# Altium project RFR_Charging_2025_Circuit.PrjPcb
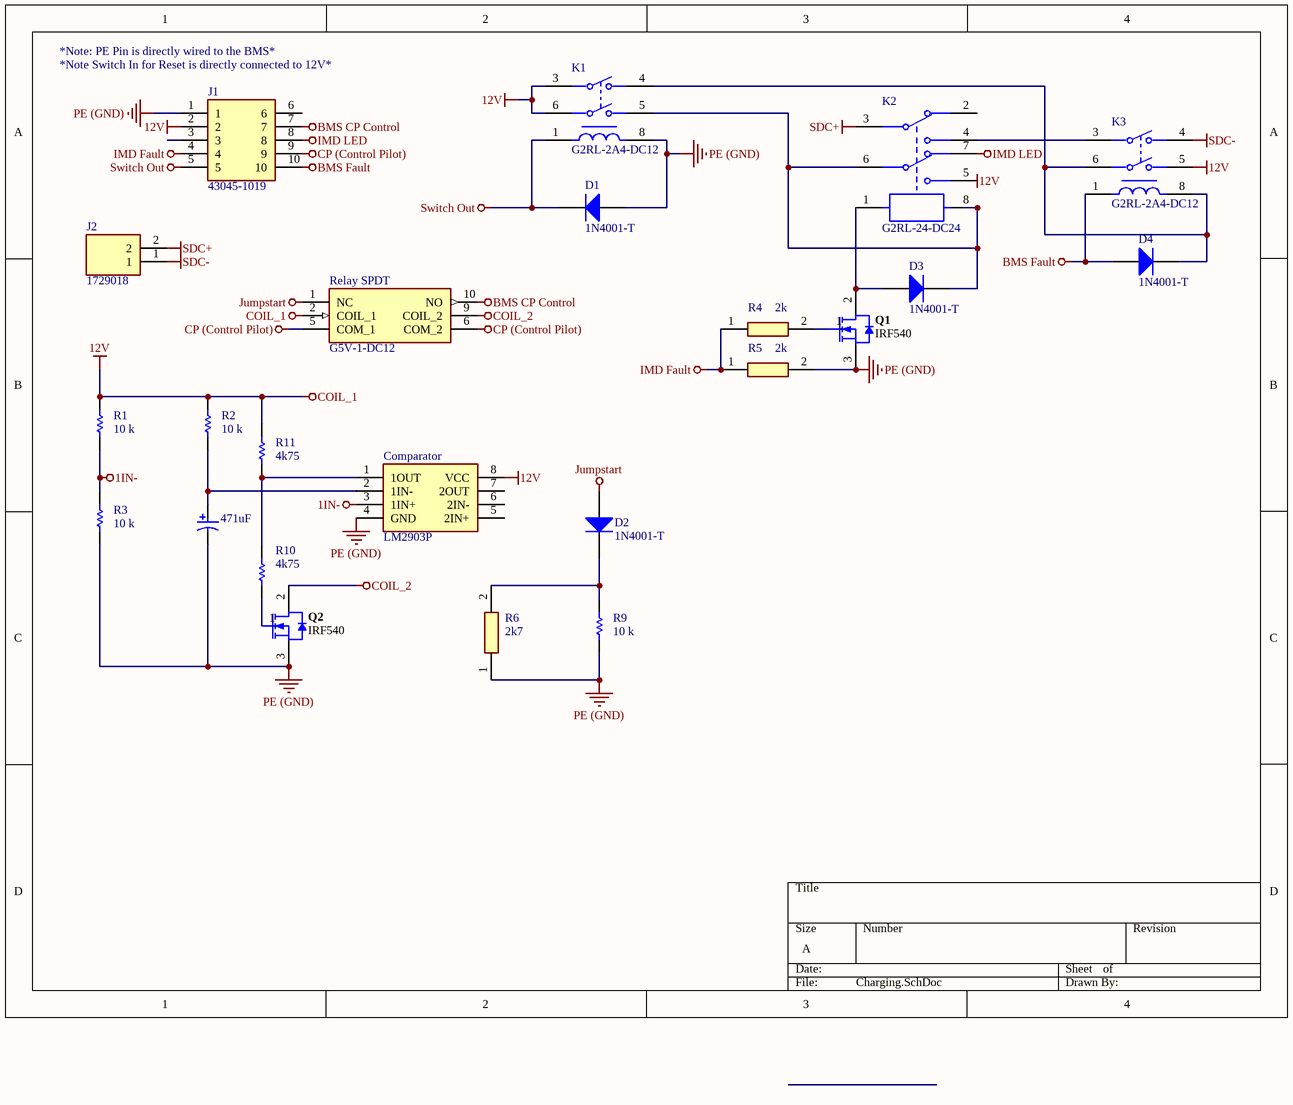
[diagram p0: Charging.SchDoc]
1 sheet, 23 parts. Net scope: global (net labels, ports and power ports of the same name join across sheets).
Board file: Charging.PcbDoc

## Sheet Charging.SchDoc
size A; SheetNumber: 1; SheetTotal: 1

### Parts
471uF  ECA-1JHG471  [CAPPR65-500-2000X1250X2200]  (value not drawn)
Comparator  LM2903P  [DIP794W53P254L959H508Q8N]
D1  1N4001-T  [DIOD-DO-41-P-2_V]
D2  1N4001-T  [DIOD-DO-41-P-2_V]
D3  1N4001-T  [DIOD-DO-41-P-2_V]
D4  1N4001-T  [DIOD-DO-41-P-2_V]
J1  43045-1019  [43045-10YY_181920]
J2  1729018  [1729018]
K1  G2RL-2A4-DC12  [FP-G2RL-2A4-DC12-MFG]
K2  G2RL-24-DC24  [OMRON-G2RL-24_V]
K3  G2RL-2A4-DC12  [FP-G2RL-2A4-DC12-MFG]
Q1  IRF540  [VISH-TO-220AB-3_A]
Q2  IRF540  [VISH-TO-220AB-3_A]
R1  Resistance: 10 k  [RESA60-630X240]  (hidden comment: MFR-25FBF52-1K)
R2  Resistance: 10 k  [RESA60-630X240]  (hidden comment: MFR-25FBF52-1K)
R3  Resistance: 10 k  [RESA60-630X240]  (hidden comment: MFR-25FBF52-1K)
R4  Resistance: 2k  [RESAD1590W60L630D240]  (hidden comment: MFR-25FBF52-2K)
R5  Resistance: 2k  [RESAD1590W60L630D240]  (hidden comment: MFR-25FBF52-2K)
R6  Resistance: 2k7  [RESAD1590W60L630D240]  (hidden comment: 2.7k)
R9  Resistance: 10 k  [RESA60-630X240]  (hidden comment: MFR-25FBF52-1K)
R10  Resistance: 4k75  [RESA60-630X240]  (hidden comment: 4.75 k)
R11  Resistance: 4k75  [RESA60-630X240]  (hidden comment: 4.75 k)
Relay_SPDT  G5V-1-DC12  [G5V1DC12]

### Nets
1IN-: Comparator.3(1IN+) R1.1 R3.2
12V: Comparator.8(VCC) J1.2 K1.3 K1.6 K3.5 R1.2 R2.2 R11.2 Relay_SPDT.2(COIL_1)  [also labelled COIL_1]
BMS CP Control: J1.7 Relay_SPDT.10(NO)
BMS Fault: D4.1(A) J1.10 K3.1
COIL_2: Q2.2(D) Relay_SPDT.9(COIL_2)
CP (Control Pilot): J1.9 Relay_SPDT.5(COM_1) Relay_SPDT.6(COM_2)
IMD Fault: J1.4 R4.1 R5.1
IMD LED: J1.8 K2.7
Jumpstart: D2.1(A) Relay_SPDT.1(NC)
PE (GND): 471uF.2 Comparator.4(GND) D1.1(A) J1.1 K1.8 Q1.3(S) Q2.3(S) R3.1 R5.2 R6.1 R9.1
SDC+: J2.2 K2.3
SDC-: J2.1 K3.4
Switch Out: D1.2(K) J1.5 K1.1
Net471uF_1: 471uF.1 Comparator.2(1IN-) R2.1
NetComparator_1: Comparator.1(1OUT) R10.1 R11.1
NetD2_2: D2.2(K) R6.2 R9.2
NetD3_1: D3.1(A) K2.1 Q1.2(D)
NetD3_2: D3.2(K) K1.5 K2.6 K2.8
NetD4_2: D4.2(K) K1.4 K3.6 K3.8
NetK2_4: K2.4 K3.3
NetQ1_1: Q1.1(G) R4.2
NetQ2_1: Q2.1(G) R10.2

Not connected (* = marked no-connect by the designer): Comparator 5(2IN+) 6(2IN-) 7(2OUT); J1 3 6; K2 2 5

### Notes on the sheet
- *Note: PE Pin is directly wired to the BMS*
- (near J1) *Note Switch In for Reset is directly connected to 12V*
- Labels drawn without touching a wire or pin: 12V

### Library data of the parts
471uF = CMP-1665-00014-4: Aluminum Electrolytic Capacitor (Radial Lead Type), 470 uF, 63 V, -55 to 105 degC, 2-Pin THD, RoHS, Bulk; Manufacturer: Panasonic; Voltage Rating: 63 V; Lead Pitch: 5 mm; ComponentLink2URL: http://industrial.panasonic.com/cdbs/www-data/pdf/RDF0000/ABA0000C1038.pdf; DatasheetVersion: 03/2016; ComponentLink1URL: http://www.panasonic.com/; Mount: Through Hole; Max Operating Temperature: 105 degC; Pins: 2; Packaging: Bulk; ComponentLink1Description: Manufacturer URL; Height: 20 mm; REACH SVHC: No SVHC; RoHSCompliant: true; Mounting Technology: Through Hole; PackageDescription: 2-Pin Through Hole Device, Dia 12.5 mm, Body Length 20 mm; Package Quantity: 200; Min Operating Temperature: -55 degC; PackageReference: Radial; ComponentLink2Description: Datasheet; Length: 20 mm
Comparator = LM2903P: Integrated Circuit; Manufacturer_Name: Texas Instruments; Datasheet Link: http://www.ti.com/lit/ds/symlink/lm2903.pdf; Height: 5.08mm; Manufacturer_Part_Number: LM2903P; Mouser Part Number: 595-LM2903P; Mouser Price/Stock: https://www.mouser.co.uk/ProductDetail/Texas-Instruments/LM2903P?qs=3pnr37ZAbK83YuwoFcyYVA%3D%3D; Arrow Part Number: LM2903P; Arrow Price/Stock: https://www.arrow.com/en/products/lm2903p/texas-instruments?utm_currency=USD&region=nac
D1-D4 = CMP-0639-00006-2: 1.0 A Rectifier, 15 pF, 50 V, -65 to 150 degC, 2-Pin DO-41 Plastic, RoHS, Tape and Reel; Manufacturer: Diodes Inc; VF (V): 1; CT (pF): 15; Max. IR (uA): 5; VRRM (V): 50; Max. IFSM (A): 30; RoHS: TRUE; Mounting Technology: Through Hole; PartNumber: 1N4001-T; ComponentLink2Description: Datasheet; DatasheetVersion: Rev. 8-2; Operating Temperature Range (degC): -65 to 150; Packing: Tape and Reel; PackageReference: DO-41-P-2; ComponentLink1URL: http://diodes.com/; PackageDescription: 2-Pin Axial Lead, Body 4.635 x 2.36 mm, Lead Spread 25.4 mm; ComponentLink2URL: http://diodes.com/datasheets/ds28002.pdf; Max. Average Rectified Current IO (A): 1; ComponentLink1Description: Manufacturer URL
J1 = 43045-1019: Connector; Manufacturer_Name: Molex; Datasheet Link: https://www.molex.com/pdm_docs/sd/430450218_sd.pdf; Height: 9.91mm; Manufacturer_Part_Number: 43045-1019; Mouser Part Number: 538-43045-1019; Mouser Price/Stock: https://www.mouser.co.uk/ProductDetail/Molex/43045-1019?qs=OWQJ9aScCGICje0BO%252BCnwQ%3D%3D; Arrow Part Number: 43045-1019; Arrow Price/Stock: https://www.arrow.com/en/products/43045-1019/molex?region=nac
J2 = 1729018: Connector; Manufacturer_Name: Phoenix Contact; Datasheet Link: http://www.phoenixcontact.com/de/produkte/1729018/pdf; Height: 10.15mm; Manufacturer_Part_Number: 1729018; Mouser Part Number: 651-1729018; Mouser Price/Stock: https://www.mouser.co.uk/ProductDetail/Phoenix-Contact/1729018?qs=cq3Rj917t3kvawwx9wVa9g%3D%3D; Arrow Part Number: 1729018; Arrow Price/Stock: https://www.arrow.com/en/products/1729018/phoenix-contact?region=nac
K1 K3 = CMP-08822-000182-1: RELAY GEN PURPOSE DPST 8A 12V; Coil Resistance: 360R; Power Consumption: 400mW; Operate Time: 15ms; Max Voltage Rating (AC): 440V; Coil Current: 33.3mA; Coil Type: Non-Latching; Relay Type: General Purpose; Max Voltage Rating (DC): 300V; Release Time: 5ms; Radiation Hardening: No; Max Current Rating: 8A; Coil Voltage (DC): 12V; Min Operating Temperature: -40°C; Series: G2RL; Termination: PC Pin; Number of Pins: 6; Mount: Through Hole; Case/Package: DIP; Max Operating Temperature: 85°C; Width: 12.7mm; Package Quantity: 20; Throw Configuration: DPST; Contact Current Rating: 8A; Length: 29mm; Packaging: Bulk; Weight: 12g; Contact Material: Silver; Coil Power: 400mW; Height: 15.7mm
K2 = CMP-2000-06305-1: Low Profile Power Relay with 15.7 mm Height, Ideal for Incorporation in Miniature Equipment, 24 V, -40 to 85 degC, 8-Pin THD, RoHS, Bulk; Manufacturer: Omron; Contact Form: DPDT(2FormC); Coil Current: 16.7mA; Coil Type: Non-Latching; Contact Termination: Pin; Brand: OmronElectronics; Power Consumption: 400mW; Coil Voltage: 24V; Coil Resistance: 1.44kOhms; Product: PowerRelays; Series: G2RL-2; Length: 29mm; Factory Pack Quantity: 20; Height: 15.7mm; Mounting Technology: ThroughHole; Product Category: GeneralPurposeRelays; Datasheet URL: http://www.omron.com/ecb/products/pdf/en-g2rl.pdf; Package Description: 8-Pin Through Hole Device, Body 28.8 x 12.5 mm; Manufacturer URL: http://www.omron.com/; Type: HighCurrent; Contact Material: SilverNickel; Package Reference: G2RL-24; Datasheet Version: 03/2016; Width: 12.7mm; Mounting Style: ThroughHole; RoHS: Details
Q1 Q2 = CMP-2000-06461-1: Power MOSFET, 100 VDS, -55 to 175 degC, 3-Pin TO-220AB, RoHS, Tube; Manufacturer: Vishay; Typical Turn-Off Delay Time: 53ns; Channel Mode: Enhancement; Unit Weight: 0.211644oz; Transistor Type: 1N-Channel; Vgs - Gate-Source Voltage: 20V; Transistor Polarity: N-Channel; Vds - Drain-Source Breakdown Voltage: 100V; Configuration: Single; Number of Channels: 1Channel; Pd - Power Dissipation: 150W; Brand: VishaySemiconductors; Rds On - Drain-Source Resistance: 77mOhms; Id - Continuous Drain Current: 28A; Rise Time: 44ns; Fall Time: 43ns; Typical Turn-On Delay Time: 11ns; &lt;PCN&gt;: http://www.mouser.com/PCN/Vishay_SIL_0182015.pdf; Maximum Operating Temperature: +175C; Product Category: MOSFET; Datasheet URL: http://www.vishay.com/docs/91021/91021.pdf; Length: 10.51mm; Height: 9.01mm; Factory Pack Quantity: 50; Width: 4.7mm; Packaging: Tube; Package Reference: TO-220AB-3; Package / Case: TO-220-3; Mounting Style: ThroughHole; Manufacturer URL: http://www.vishay.com/; Mounting Technology: ThroughHole; Package URL: http://www.vishay.com/docs/71195/to220ab.pdf; RoHS: NoRoHSVersionAvailable; Technology: Si; Minimum Operating Temperature: -55C; Package Description: 3-Pin Flange Mount, Body 10.275 x 4.45 mm, Pitch 2.54 mm; Datasheet Version: Rev. B, 03/2011
R1-R3 R9 = CMP-1659-00075-1: Axial Resistor, 1 KOhm, +/- 1%, 250 mW, -55 to 155 degC, 2-Pin THD, RoHS, Bulk; Voltage Rating: 250 V; Power Rating: 250 mW; ComponentLink2Description: Datasheet; RoHSCompliant: true; PackageReference: MFR-25; Case\Package: Axial; Max Operating Temperature: 155 degC; DatasheetVersion: Apr-13; Tolerance: 1%; ComponentLink1URL: http://www.yageo.com/; Length: 0.248 inch; ComponentLink2URL: http://www.yageo.com/documents/recent/Yageo%20LR_MFR_2013.pdf; Packaging: Bulk; Package Quantity: 200; PackageDescription: 2-Pin Axial Lead, Dia 2.4 mm, Body Length 6.3 mm; Min Operating Temperature: -55 degC; ComponentLink1Description: Manufacturer URL
R4 R5 = MFR-25FBF52-2K: Resistor; Manufacturer_Name: YAGEO; Datasheet Link: https://www.yageo.com/upload/media/product/app/datasheet/lr/yageo-mfr_datasheet.pdf; Manufacturer_Part_Number: MFR-25FBF52-2K
R6 = CFR-25JB-52-2K7: Resistor; Manufacturer_Name: KEMET; Datasheet Link: https://www.yageo.com/upload/media/product/productsearch/datasheet/lr/YAGEO%20CFR_datasheet_2021v0.pdf; Manufacturer_Part_Number: CFR-25JB-52-2K7; Mouser Part Number: 603-CFR-25JB-52-2K7; Mouser Price/Stock: https://www.mouser.com/Search/Refine.aspx?Keyword=603-CFR-25JB-52-2K7
R10 R11 = CMP-1659-00066-1: Axial Resistor, 4.75 KOhm, +/- 1%, 0.25 W, -55 to 155 degC, 2-Pin THD, RoHS, Bulk; Case\Package: 1210; Voltage Rating (DC): 25 V; Type (Capacitors): X7R; Capacitance: 22 uF; Tolerance: 10%; PackageReference: MFR-25; DatasheetVersion: Apr-13; PackageDescription: 2-Pin Axial Lead, Dia 2.4 mm, Body Length 6.3 mm; ComponentLink1URL: http://www.yageo.com/; Radiation Hardening: No; Mount: Surface Mount; Height: 2.5 mm; Pins: 2; Package Quantity: 1000; REACH SVHC: No SVHC; Case Code (Imperial): 1210; Packaging: Tape and Reel; Max Operating Temperature: 125 degC; Case Code (Metric): 3225; ComponentLink1Description: Manufacturer URL; Min Operating Temperature: -55 degC; ComponentLink2Description: Datasheet; Voltage Rating: 25 V; Length: 3.2 mm; ComponentLink2URL: http://www.yageo.com/documents/recent/Yageo%20LR_MFR_2013.pdf; RoHSCompliant: true; Width: 2.5 mm
Relay_SPDT = G5V-1-DC12: Relay or Contactor; Manufacturer_Name: Omron Electronics; Datasheet Link: https://componentsearchengine.com/Datasheets/1/G5V-1-DC12.pdf; Height: 10mm; Manufacturer_Part_Number: G5V-1-DC12; Mouser Part Number: 653-G5V-1-DC12; Mouser Price/Stock: https://www.mouser.co.uk/ProductDetail/Omron-Electronics/G5V-1-DC12?qs=nNiD76Ca0%252BuMuQOpoevaxA%3D%3D; Arrow Part Number: G5V-1-DC12; Arrow Price/Stock: https://www.arrow.com/en/products/g5v-1-dc12/omron?region=nac